# Altium schematic sheet REIS_PCB.SchDoc
size 594 x 420 mm; SheetNumber: 1; SheetTotal: 1; ListNumber: 1
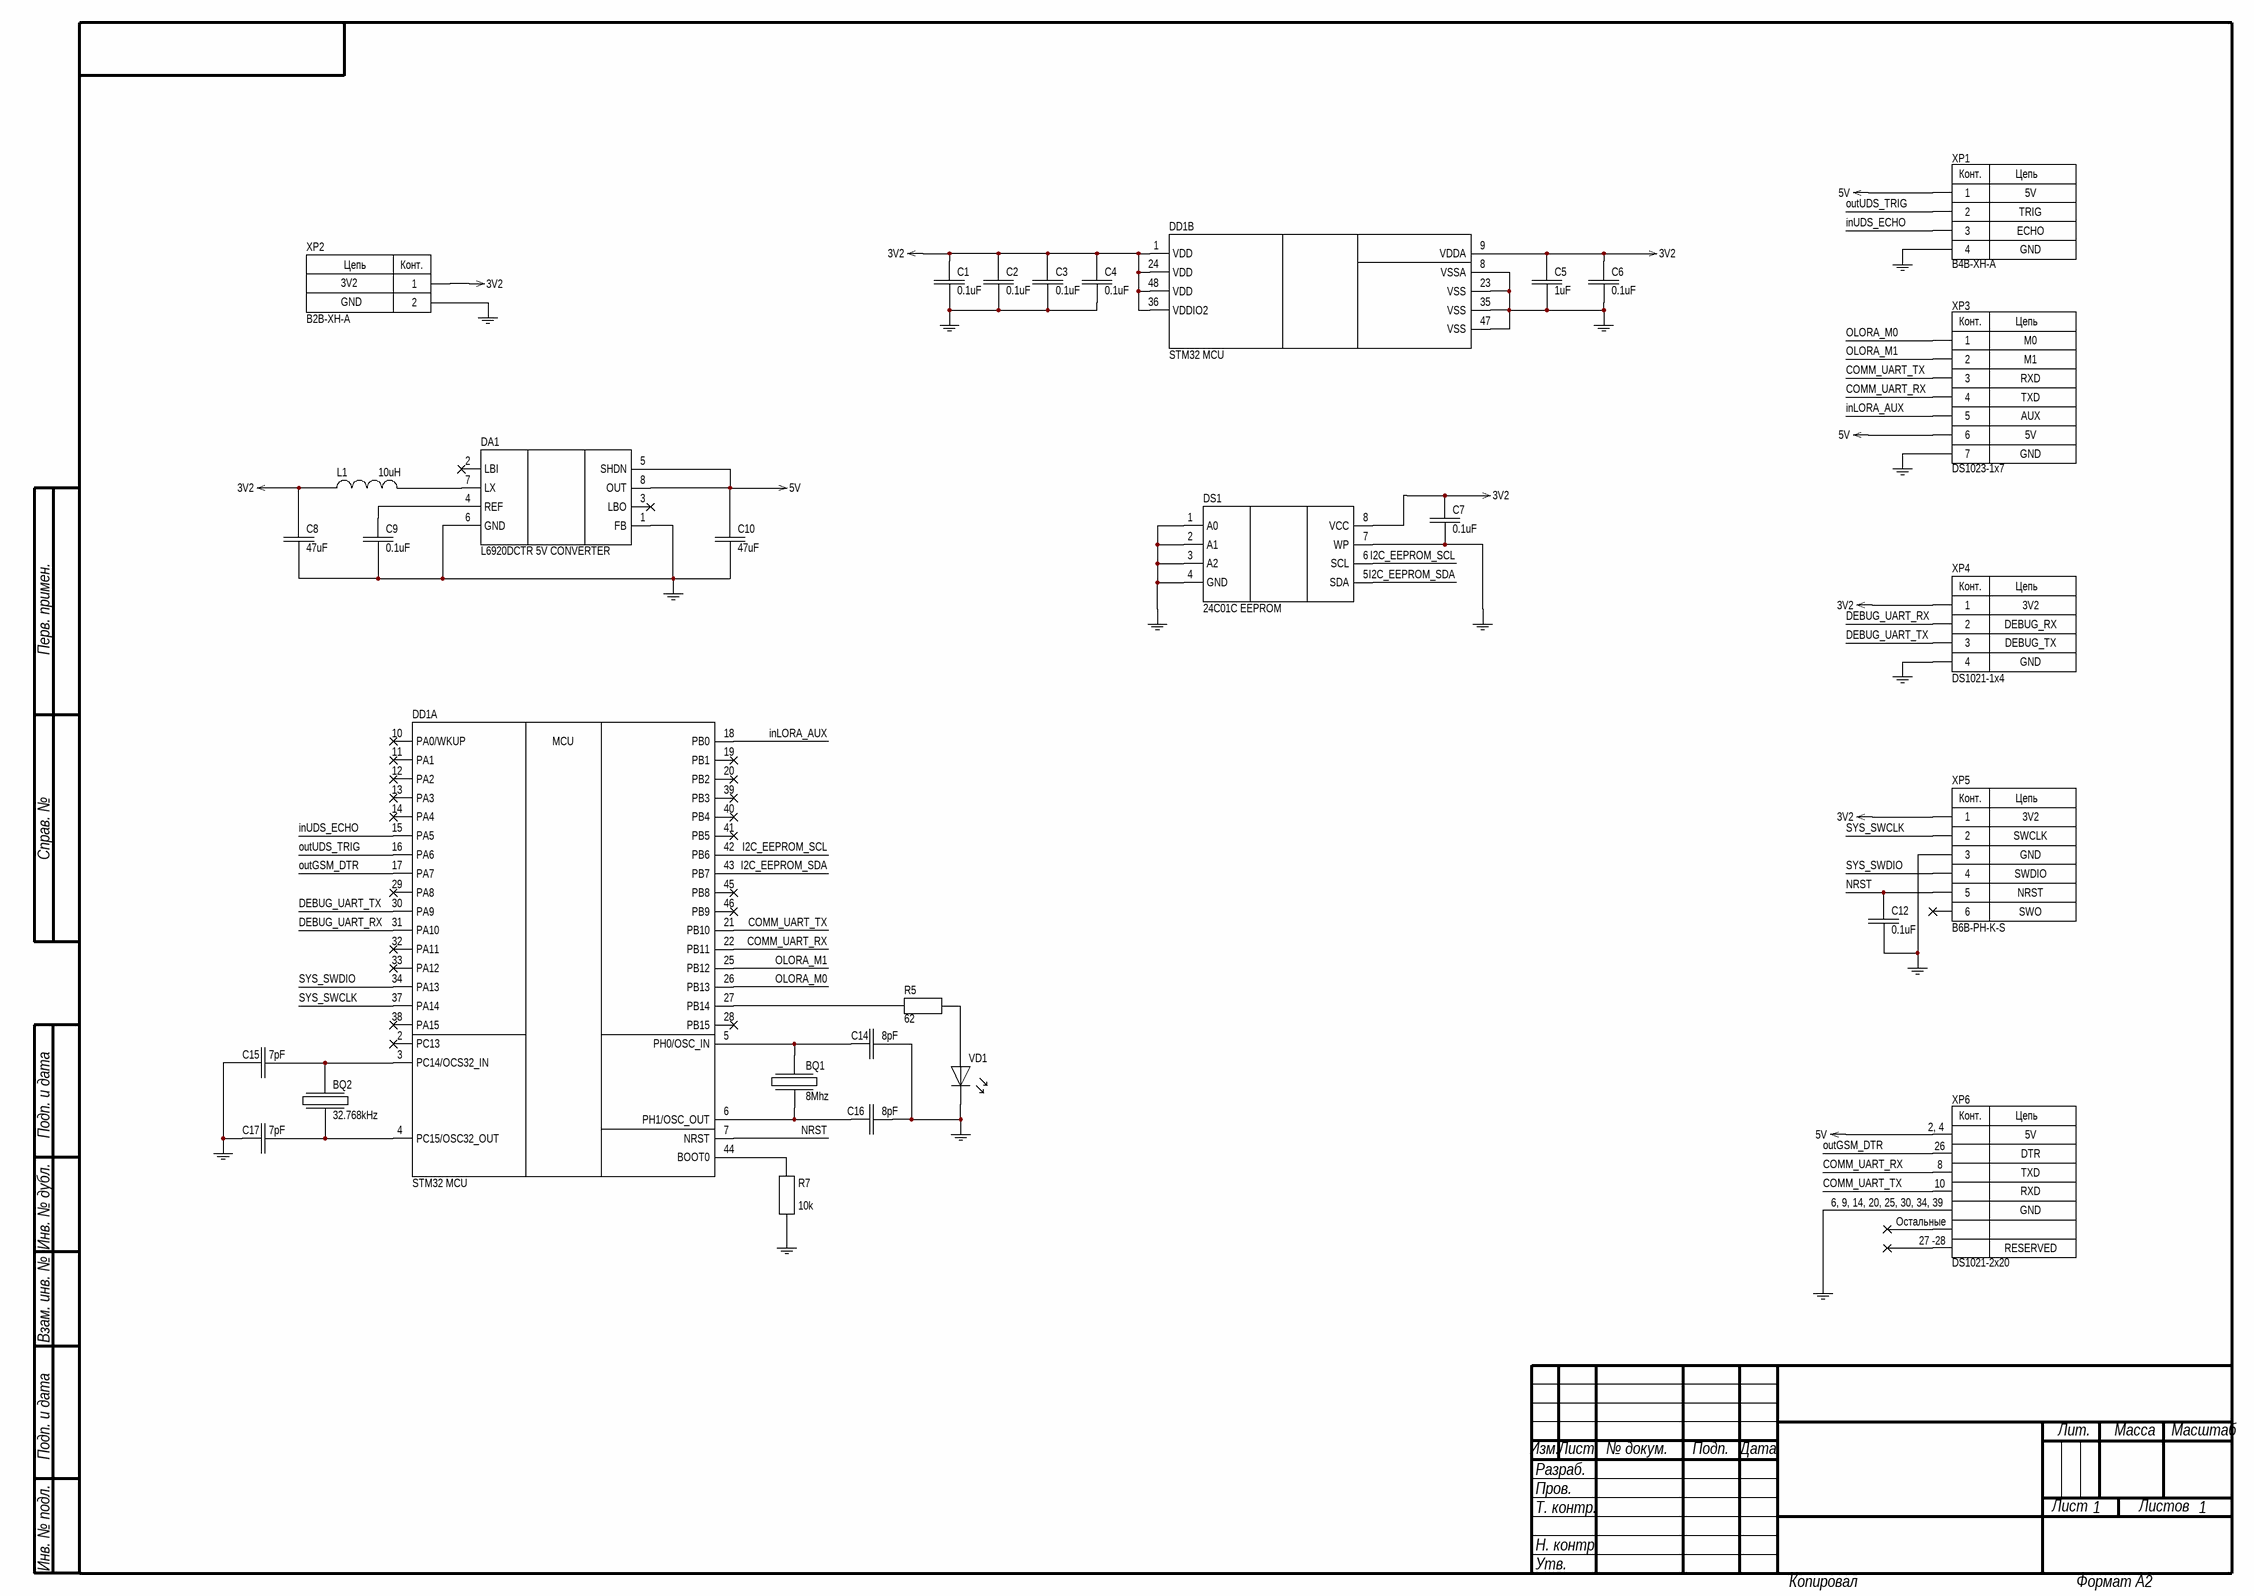
[diagram p0: REIS_PCB.SchDoc]

## Parts
BQ1  Frequency: 8Mhz  [NX5032GA-8MHz]  (hidden comment: NX5032GA-8MHz)
BQ2  Frequency: 32.768kHz  [NX3215SA-32.768kHz]  (hidden comment: NX3215SA-32.768K)
C1  Capacity: 0.1uF  [0603]  (hidden comment: GRM188R71H104JA93D)
C2  Capacity: 0.1uF  [0603]  (hidden comment: GRM188R71H104JA93D)
C3  Capacity: 0.1uF  [0603]  (hidden comment: GRM188R71H104JA93D)
C4  Capacity: 0.1uF  [0603]  (hidden comment: GRM188R71H104JA93D)
C5  Capacity: 1uF  [0603]  (hidden comment: GRM188R71E105KA12D)
C6  Capacity: 0.1uF  [0603]  (hidden comment: GRM188R71H104JA93D)
C7  Capacity: 0.1uF  [0603]  (hidden comment: GRM188R71H104JA93D)
C8  Capacity: 47uF  [1206]  (hidden comment: GRM319R61E475K)
C9  Capacity: 0.1uF  [0603]  (hidden comment: GRM188R71H104JA93D)
C10  Capacity: 47uF  [1206]  (hidden comment: GRM319R61E475K)
C12  Capacity: 0.1uF  [0603]  (hidden comment: GRM188R71H104JA93D)
C14  Capacity: 8pF  [0603]  (hidden comment: CC0603DRNPO9BN8R0)
C15  Capacity: 7pF  [0603]  (hidden comment: CC0603CRNPO9BN7R0)
C16  Capacity: 8pF  [0603]  (hidden comment: CC0603DRNPO9BN8R0)
C17  Capacity: 7pF  [0603]  (hidden comment: CC0603CRNPO9BN7R0)
DA1  L6920DCTR 5V CONVERTER  [MSOP]
DD1  STM32 MCU  [LQFP48]  (parts A,B of 2)
DS1  24C01C EEPROM  [SOIC8]
L1  Inductance: 10uH  [2220]  (hidden comment: LQH55DN100M)
R5  Resistance: 62  [0603]  (hidden comment: RC0603JR-0762RL)
R7  Resistance: 10k  [0603]  (hidden comment: RC0603FR-0710KL)
VD1  GNL-0603EC  [0603LED]  (value not drawn)
XP1  B4B-XH-A  Parameter 1: 5V  Parameter 2: TRIG  Parameter 3: ECHO  Parameter 4: GND  [B4B-XH-A]
XP2  B2B-XH-A  Parameter 1: 3V2  Parameter 2: GND  [B2B-XH-A]
XP3  DS1023-1x7  Parameter 1: M0  Parameter 2: M1  Parameter 3: RXD  Parameter 4: TXD  Parameter 5: AUX  Parameter 6: 5V  Parameter 7: GND  [DS1023-1x7]
XP4  DS1021-1x4  Parameter 1: 3V2  Parameter 2: DEBUG_RX  Parameter 3: DEBUG_TX  Parameter 4: GND  [DS1021-1x4]
XP5  B6B-PH-K-S  Parameter 1: 3V2  Parameter 2: SWCLK  Parameter 3: GND  Parameter 4: SWDIO  Parameter 5: NRST  Parameter 6: SWO  [B6B-PH-K-S]
XP6  DS1021-2x20  Parameter 1: 5V  Parameter 2: DTR  Parameter 3: TXD  Parameter 4: RXD  Parameter 5: GND  Parameter 7: RESERVED  [DS1021-2x20]

## Nets
3V2: C1.2 C2.2 C3.2 C4.2 C5.2 C6.2 C7.2 C8.2 DD1.1(VDD) DD1.9(VDDA) DD1.24(VDD) DD1.36(VDDIO2) DD1.48(VDD) DS1.8(VCC) L1.1 XP2.1 XP4.1 XP5.1
5V: C10.2 DA1.5(SHDN) DA1.8(OUT) XP1.1 XP3.6 XP6.2
GND: C1.1 C2.1 C3.1 C4.1 C5.1 C6.1 C7.1 C8.1 C9.1 C10.1 C12.1 C14.1 C15.1 C16.1 C17.1 DA1.1(FB) DA1.6(GND) DD1.8(VSSA) DD1.23(VSS) DD1.35(VSS) DD1.47(VSS) DS1.1(A0) DS1.2(A1) DS1.3(A2) DS1.4(GND) DS1.7(WP) R7.1 VD1.2 XP1.4 XP2.2 XP3.7 XP4.4 XP5.3 XP6.6
COMM_UART_RX: DD1.22(PB11) XP3.4 XP6.8
COMM_UART_TX: DD1.21(PB10) XP3.3 XP6.10
DEBUG_UART_RX: DD1.31(PA10) XP4.2
DEBUG_UART_TX: DD1.30(PA9) XP4.3
I2C_EEPROM_SCL: DD1.42(PB6) DS1.6(SCL)
I2C_EEPROM_SDA: DD1.43(PB7) DS1.5(SDA)
inLORA_AUX: DD1.18(PB0) XP3.5
inUDS_ECHO: DD1.15(PA5) XP1.3
NRST: C12.2 DD1.7(NRST) XP5.5
OLORA_M0: DD1.26(PB13) XP3.1
OLORA_M1: DD1.25(PB12) XP3.2
outGSM_DTR: DD1.17(PA7) XP6.26
outUDS_TRIG: DD1.16(PA6) XP1.2
SYS_SWCLK: DD1.37(PA14) XP5.2
SYS_SWDIO: DD1.34(PA13) XP5.4
NetBQ1_1: BQ1.1 C16.2 DD1.6(PH1/OSC_OUT)
NetBQ1_2: BQ1.2 C14.2 DD1.5(PH0/OSC_IN)
NetBQ2_1: BQ2.1 C17.2 DD1.4(PC15/OSC32_OUT)
NetBQ2_2: BQ2.2 C15.2 DD1.3(PC14/OCS32_IN)
NetC9_2: C9.2 DA1.4(REF)
NetDA1_7: DA1.7(LX) L1.2
NetDD1_27: DD1.27(PB14) R5.2
NetDD1_44: DD1.44(BOOT0) R7.2
NetR5_1: R5.1 VD1.1

Not connected (* = marked no-connect by the designer): DA1 2(LBI)* 3(LBO)*; DD1 2(PC13)* 10(PA0/WKUP)* 11(PA1)* 12(PA2)* 13(PA3)* 14(PA4)* 19(PB1)* 20(PB2)* 28(PB15)* 29(PA8)* 32(PA11)* 33(PA12)* 38(PA15)* 39(PB3)* 40(PB4)* 41(PB5)* 45(PB8)* 46(PB9)*; XP5 6*; XP6 7(6)* 27(7)*

## Notes on the sheet
- (near XP6) 2, 4
- (near XP6) 26
- (near XP6) 10
- (near XP6) 8
- (near XP6) 6, 9, 14, 20, 25, 30, 34, 39
- (near XP6) Остальные
- (near XP6) 27 -28
- Перв. примен.
- Справ. №
- Подп. и дата
- Инв. № дубл.
- Взам. инв. №
- Разраб.
- Изм.
- Лист
- № докум.
- Подп.
- Дата
- Лит.
- Масса
- Масштаб
- Пров.
- Т. контр.
- Листов
- Инв. № подл.
- Н. контр.
- Утв.
- Копировал
- Формат А2
- (in symbol 24C01C-SSHM-T) /
- (in symbol B2B-XH-A) Цепь; Конт.
- (in symbol B4B-XH-A) Конт.; Цепь
- (in symbol B6B-PH-K-S) Конт.; Цепь
- (in symbol DS1021-1x4) Конт.; Цепь
- (in symbol DS1021-2x20) Конт.; Цепь
- (in symbol DS1023-1x7) Конт.; Цепь
- (in symbol L6920DCTR) /
- (in symbol STM32L051C8T6, part A) MCU

## Library data of the parts
BQ1 = NX5032GA-8MHz: 8MHz resonator; Manufacturer: NDK; Name: *; Family: Кварцевый резонатор; Model: NX5032GA-8MHz; ТУ: *; Pins: 2; Package: SMD
BQ2 = NX3215SA-32.768K: 32.768kHz resonator; Manufacturer: NDK; Name: *; Family: Кварцевый резонатор; Model: NX3215SA-32.768K; ТУ: *; Pins: 4; Package: SMD
C1-C4 C6 C7 C9 C12 = GRM188R71H104JA93D: 0.1uF capacitor; Manufacturer: Murata; Voltage: 50V; Name: *; Family: Конденсатор; Model: GRM188R71H104JA93D; ТУ: *; Pins: 2; Package: 0603
C5 = GRM188R71E105KA12D: 1uF capacitor; Manufacturer: Murata; Voltage: 25V; Name: *; Family: Конденсатор; Model: GRM188R71E105KA12D; ТУ: *; Pins: 2; Package: 0603
C8 C10 = GRM319R61E475K: 47uF capacitor; Manufacturer: Murata; Voltage: 25V; Name: *; Family: Конденсатор; Model: GRM319R61E475K; ТУ: *; Pins: 2; Package: 1206
C14 C16 = CC0603DRNPO9BN8R0: 8pF capacitor; Manufacturer: Yageo; Voltage: 50V; Name: *; Family: Конденсатор; Model: CC0603DRNPO9BN8R0; ТУ: *; Pins: 2; Package: 0603
C15 C17 = CC0603CRNPO9BN7R0: 7pF capacitor; Manufacturer: Yageo; Voltage: 50V; Name: *; Family: Конденсатор; Model: CC0603CRNPO9BN7R0; ТУ: *; Pins: 2; Package: 0603
DA1 = L6920DCTR: Synchronous rectifier step up converter; Manufacturer: STMicroelectronics; Family: Микросхема; Model: L6920DCTR; ТУ: *; Name: *; Pins: 8; Package: MSOP
DD1 = STM32L051C8T6: MCU STM32; Manufacturer: STMicroelectronics; Name: *; Family: Микросхема; Model: STM32L051C8T6; ТУ: *; Pins: 48; Package: LQFP48
DS1 = 24C01C-SSHM-T: Serial EEPROM; Manufacturer: Atmel; Family: Микросхема; Model: 24C01C-SSHM-T; ТУ: *; Package: SOIC8; Pins: 8
L1 = LQH55DN100M: 10 uH inductor; Manufacturer: Murata; Name: *; Family: Катушка индуктивности; Model: LQH55DN100M; ТУ: *; Pins: 2; Package: 2220
R5 = RC0603JR-0762RL: 62Ohm resistor; Manufacturer: Тайвань; Family: *; Model: RC0603JR-0762RL; ТУ: *; Pins: 2; Package: 0603
R7 = RC0603FR-0710KL: 10k resistor; Name: *; Family: Резистор; Model: RC0603FR-0710KL; Manufacturer: -; ТУ: *; Pins: 2; Package: 0603
VD1 = GNL-0603EC: Red light-emitting diode; Manufacturer: G-nor; Name: *; Family: Диод; Model: GNL-0603EC; ТУ: *; Pins: 2; Package: 0603
XP1 = B4B-XH-A: Connector 4pin; Manufacturer: JST; Name: *; Family: Разъём; Model: B4B-XH-A; ТУ: *; Pins: 4; Package: Conn
XP2 = B2B-XH-A: Power connector; Manufacturer: JST; Name: *; Family: Разъём; Model: B2B-XH-A; ТУ: *; Pins: 2; Package: Conn
XP3 = DS1023-1x7: Connector E032 to PBS7_DS1023-1x7; Manufacturer: Connfly; Name: *; Family: Разъём; Model: DS1023-1x7; ТУ: *; Pins: 7; Package: Conn
XP4 = DS1021-1x4: USART connector PLS4_DS1021-1x4; Manufacturer: Connfly; Name: *; Family: Разъём; Model: DS1021-1x4; ТУ: *; Pins: 4; Package: Conn
XP5 = B6B-PH-K-S: SWDIO connector; Manufacturer: JST; Name: *; Family: Разъём; Model: B6B-PH-K-S; ТУ: *; Pins: 6; Package: Conn
XP6 = DS1021-2x20: Connector SIM7000E; Manufacturer: Connfly; Name: *; Family: Разъём; Model: DS1021-2x20; ТУ: *; Pins: 40; Package: Conn